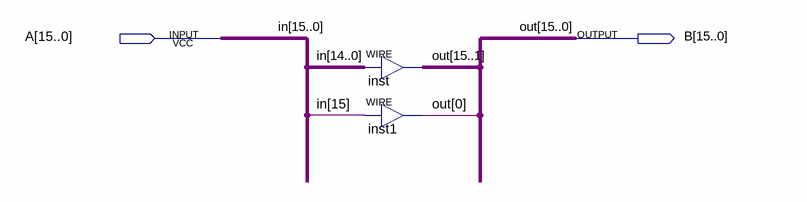
[diagram p0: schematic sheet]
// Quartus schematic shifter_8b.bdf as structural Verilog: 2 symbols, 2 pins
module shifter_8b (
  input  [15:0] A,
  output [15:0] B
);

  assign B[15:1] = A[14:0];  // WIRE inst
  assign B[0] = A[15];  // WIRE inst1

  // Other names for the same wires on the sheet: in[15:0] = A; out[15:0] = B
endmodule
